# EAGLE design dip14_a1 (EAGLE 5.11)
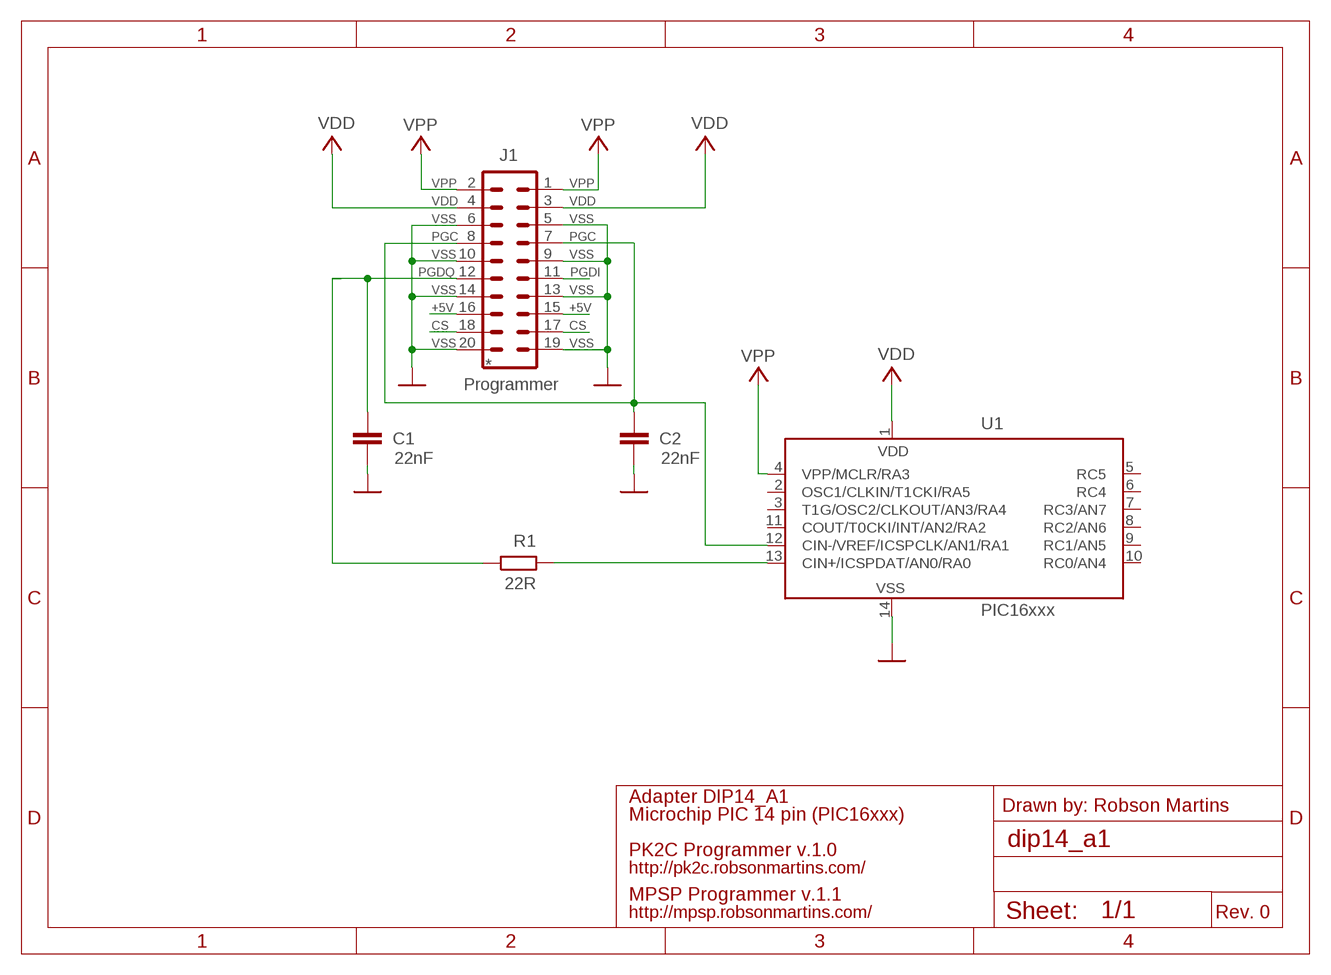
[diagram p0: schematic, sheet 1]

## Parts
C1  22nF  C-EU025-025X050  [C025-025X050]
C2  22nF  C-EU025-025X050  [C025-025X050]
J1  Programmer  MA10-2  [MA10-2]
R1  22R  R-EU_0204/7  [0204/7]
U1  PIC16xxx  PIC16F676P  [DIL14]

## Nets
+5V: J1.15 J1.16
CS: J1.17 J1.18
GND: C1.2 C2.2 J1.5 J1.6 J1.9 J1.10 J1.13 J1.14 J1.19 J1.20 U1.14(VSS)
PGC: C2.1 J1.7 J1.8 U1.12(CIN-/VREF/ICSPCLK/AN1/RA1)
PGD: C1.1 J1.12 R1.1
PGD_CHIP: R1.2 U1.13(CIN+/ICSPDAT/AN0/RA0)
PGDI: J1.11
VDD: J1.3 J1.4 U1.1(VDD)
VPP: J1.1 J1.2 U1.4(VPP/MCLR/RA3)
Unconnected: U1.2(OSC1/CLKIN/T1CKI/RA5) U1.3(T1G/OSC2/CLKOUT/AN3/RA4) U1.5(RC5) U1.6(RC4) U1.7(RC3/AN7) U1.8(RC2/AN6) U1.9(RC1/AN5) U1.10(RC0/AN4) U1.11(COUT/T0CKI/INT/AN2/RA2)

## Notes on the sheet
- VPP | VPP
- VDD | VDD
- VSS | VSS
- PGC | PGC
- VSS | VSS
- PGDQ | PGDI
- VSS | VSS
- +5V | +5V
- CS | CS
- VSS | VSS
- *
- Adapter DIP14_A1
- Drawn by: Robson Martins
- Microchip PIC 14 pin (PIC16xxx)
- PK2C Programmer v.1.0
- http://pk2c.robsonmartins.com/
- MPSP Programmer v.1.1
- http://mpsp.robsonmartins.com/ | Rev. 0

## Library data of the parts
C1 C2 = rcl:C-EU: CAPACITOR, European symbol
J1 = con-lstb:MA10-2: PIN HEADER; OC_FARNELL: unknown; OC_NEWARK: unknown
R1 = resistor:R-EU_: RESISTOR, European symbol
U1 = microchip:PIC16F676: 14-Pin, Flash-Based 8-Bit CMOS Microcontroller High Performance RISC CPU: * Only 35 instructions to learn - All single-cycle instructions except branches * Operating speed: - DC - 20 MHz oscillator/clock input - DC - 200 ns instruction cycle * Internal and external oscillator options - Precision Internal 4 MHz oscillator factory calibrated to ±1% - External Oscillator support for crystals and resonators - 5?s wake-up from SLEEP, 3.0V, typical * Power saving SLEEP mode * Wide operating voltage range - 2.0V to 5.5V * Industrial and Extended temperature range * Low power Power-on Reset (POR) * Power-up Timer (PWRT) and Oscillator Start-up Timer (OST) * Brown-out Detect (BOD) * Watchdog Timer (WDT) with independent oscillator for reliable operation * Multiplexed MCLR/Input-pin * Interrupt-on-pin change * Individual programmable weak pull-ups * Programmable code protection * High Endurance FLASH/EEPROM Cell - 100,000 write FLASH endurance - 1,000,000 write EEPROM endurance - FLASH/Data EEPROM Retention: > 40 years * Standby Current: - 1 nA @ 2.0V, typical * Operating Current: - 8.5?A @ 32 kHz, 2.0V, typical - 100?A @ 1 MHz, 2.0V, typical * Watchdog Timer Current - 300 nA @ 2.0V, typical * Timer1 oscillator current: - 4?A @ 32 kHz, 2.0V, typical * 12 I/O pins with individual direction control * High current sink/source for direct LED drive * Analog-to-Digital Converter module (PIC16F676): - 10-bit resolution - Programmable 8-channel input - Voltage reference input * In-Circuit Serial ProgrammingTM (ICSPTM) via two pins Source: http://ww1.microchip.com/downloads/en/DeviceDoc/40039E.pdf; MF: MICROCHIP; MPN: PIC16F676-I/P; OC_FARNELL: 9760512; OC_NEWARK: 54K2829

## Board
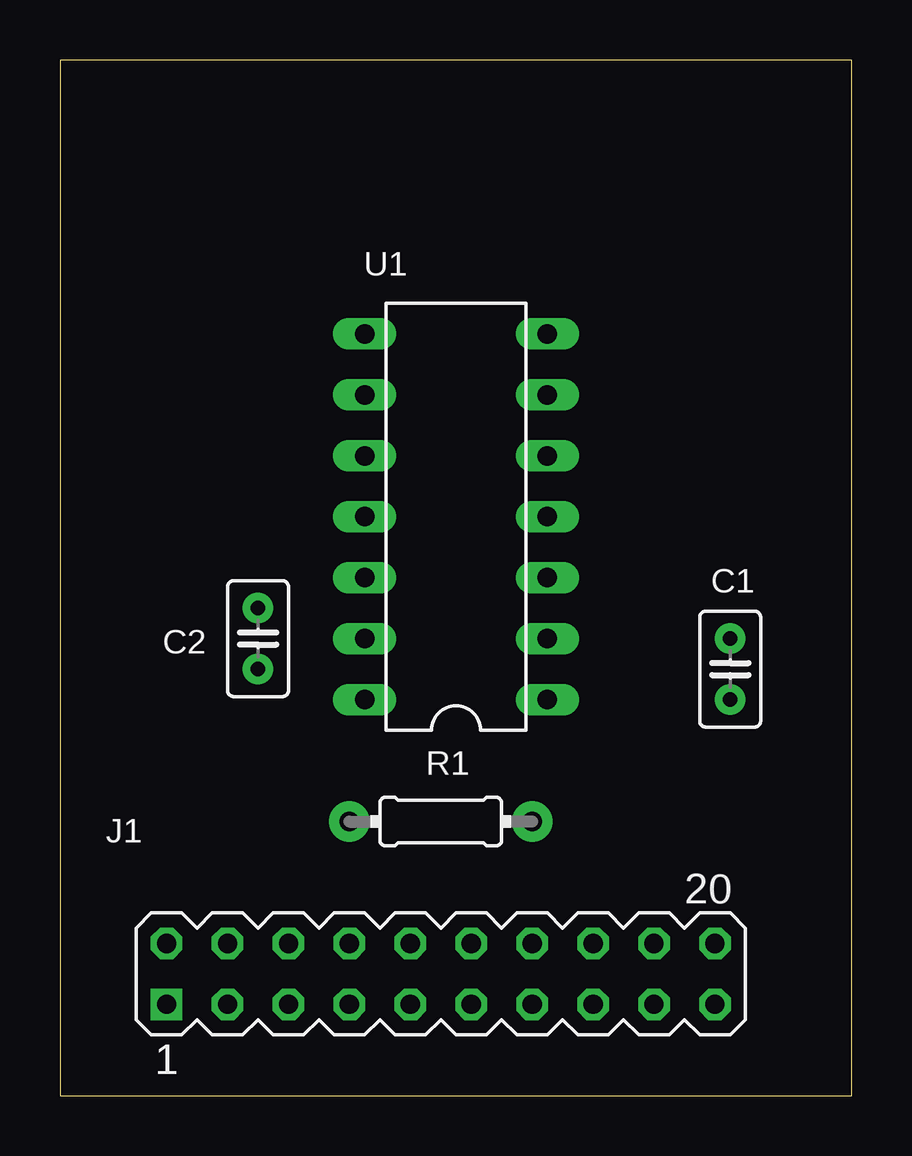
[diagram p1: board, top side]
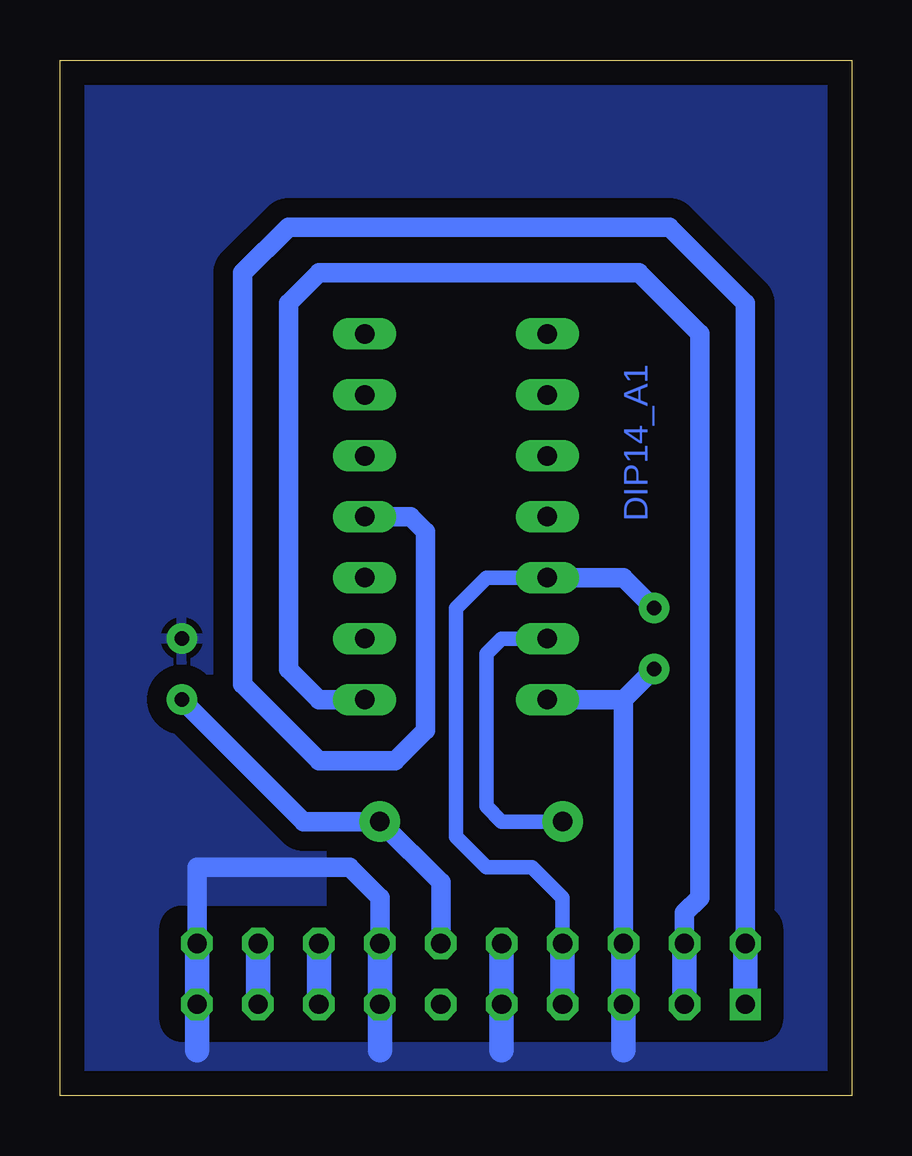
[diagram p2: board, bottom side, seen from below]

Size 33.02 x 43.16 mm. Coordinates in mm from the lower left corner, seen from the top.
Outline: 33.02,0 33.02,43.16 0,43.16 0,0 33.02,0
Copper layers (1*16): Top 0.035mm / dielectric 1.5mm / Bottom 0.035mm
Design rules "default": minimum track width 10mil, minimum drill 24mil, track to track 8mil, track to pad 8mil, pad to pad 8mil, via to via 8mil, smd to smd 8mil, copper to edge 40mil, drill to drill 8mil, minimum pad ring 10mil, minimum via ring 8mil, stop-mask expansion 4mil, vias tented up to drill 0mil, thermal gap 10mil
bRestrict: area 3.8,3.2 to 27.9,15.9; area 5.1,15.9 to 21,33

### Footprints (pad centres in the part's own frame; a part is rotated, then mirrored left to right if it is on the bottom)
C025-025X050 = drill 0.6 pad 1.27 round: 1 -1.27,0; 2 1.27,0
MA10-2 = drill 0.8 pad 1.27 square: 1 -11.43,-1.27 | drill 0.8 pad 1.27 octagon: 2 -11.43,1.27; 3 -8.89,-1.27; 4 -8.89,1.27; 5 -6.35,-1.27; 6 -6.35,1.27; 7 -3.81,-1.27; 8 -3.81,1.27; 9 -1.27,-1.27; 10 -1.27,1.27; 11 1.27,-1.27; 12 1.27,1.27; 13 3.81,-1.27; 14 3.81,1.27; 15 6.35,-1.27; 16 6.35,1.27; 17 8.89,-1.27; 18 8.89,1.27; 19 11.43,-1.27; 20 11.43,1.27
0204/7 = drill 0.813 pad 1.676 round: 1 -3.81,0 | drill 0.8 pad 1.676 round: 2 3.81,0
DIL14 = drill 0.813 long: 1 -7.62,-3.81; 2 -5.08,-3.81; 3 -2.54,-3.81; 4 0,-3.81; 5 2.54,-3.81; 6 5.08,-3.81; 7 7.62,-3.81; 8 7.62,3.81; 9 5.08,3.81; 10 2.54,3.81; 11 0,3.81; 12 -2.54,3.81; 13 -5.08,3.81; 14 -7.62,3.81

### Placement (x,y rotation side)
C1  27.94,17.78 90 top
C2  8.26,19.05 270 top
J1  15.88,5.08 0 top
R1  15.88,11.43 180 top
U1  16.51,24.13 90 top

### Tracks (layer width: path | path; a pad name or v marks a point on that pad's centre or on a via)
+5V
  Bottom 1.016: J1.15 J1.16
CS
  Bottom 1.016: J1.17 J1.18
GND
  Bottom 0.813: J1.14 19.69,8.26 20.96,9.53 27.31,9.53 J1.20 | 9.53,16.51 C2.2 9.53,16.51 | J1.6 9.53,16.51 | 9.53,16.51 U1.14
  Bottom 1.016: J1.6 J1.5 9.53,1.91 | J1.10 J1.9 14.61,1.91 | J1.14 J1.13 19.69,1.91 | J1.20 J1.19 27.31,1.91
  pour Bottom (isolate 0.813): 33.02,0 0,0 0,43.18 33.02,43.18
PGC
  Bottom 0.61: J1.8 12.07,8.26 13.34,9.53 15.24,9.53 16.51,10.79 16.51,20.32 15.24,21.59 U1.12
  Bottom 0.813: U1.12 9.53,21.59 C2.1
  Bottom 1.016: J1.7 J1.8
PGD
  Bottom 0.813: J1.12 17.15,8.89 R1.1 22.86,11.43 C1.1
PGD_CHIP
  Bottom 0.61: U1.13 14.61,19.05 15.24,18.41 15.24,12.06 14.61,11.43 R1.2
VDD
  Bottom 0.813: J1.4 6.99,7.62 6.35,8.26 6.35,23.5 6.35,31.75 8.89,34.29 22.23,34.29 23.5,33.02 23.5,17.78 22.23,16.51 U1.1
  Bottom 1.016: J1.3 J1.4
VPP
  Bottom 0.813: J1.1 4.45,7.62 4.45,8.89 4.45,26.67 4.45,33.02 7.62,36.2 23.5,36.2 25.4,34.29 25.4,17.14 22.23,13.97 19.05,13.97 17.78,15.24 17.78,23.5 18.42,24.13 U1.4
  Bottom 1.016: J1.1 J1.2

### Text on the board
Bottom: DIP14_A1
tDocu: Microchip PIC | PIC 16xxx | DIP14_A1 | Adapter | VSS | VPP | VDD | VSS | PGC | VSS | PGD | VSS | +5V | CS